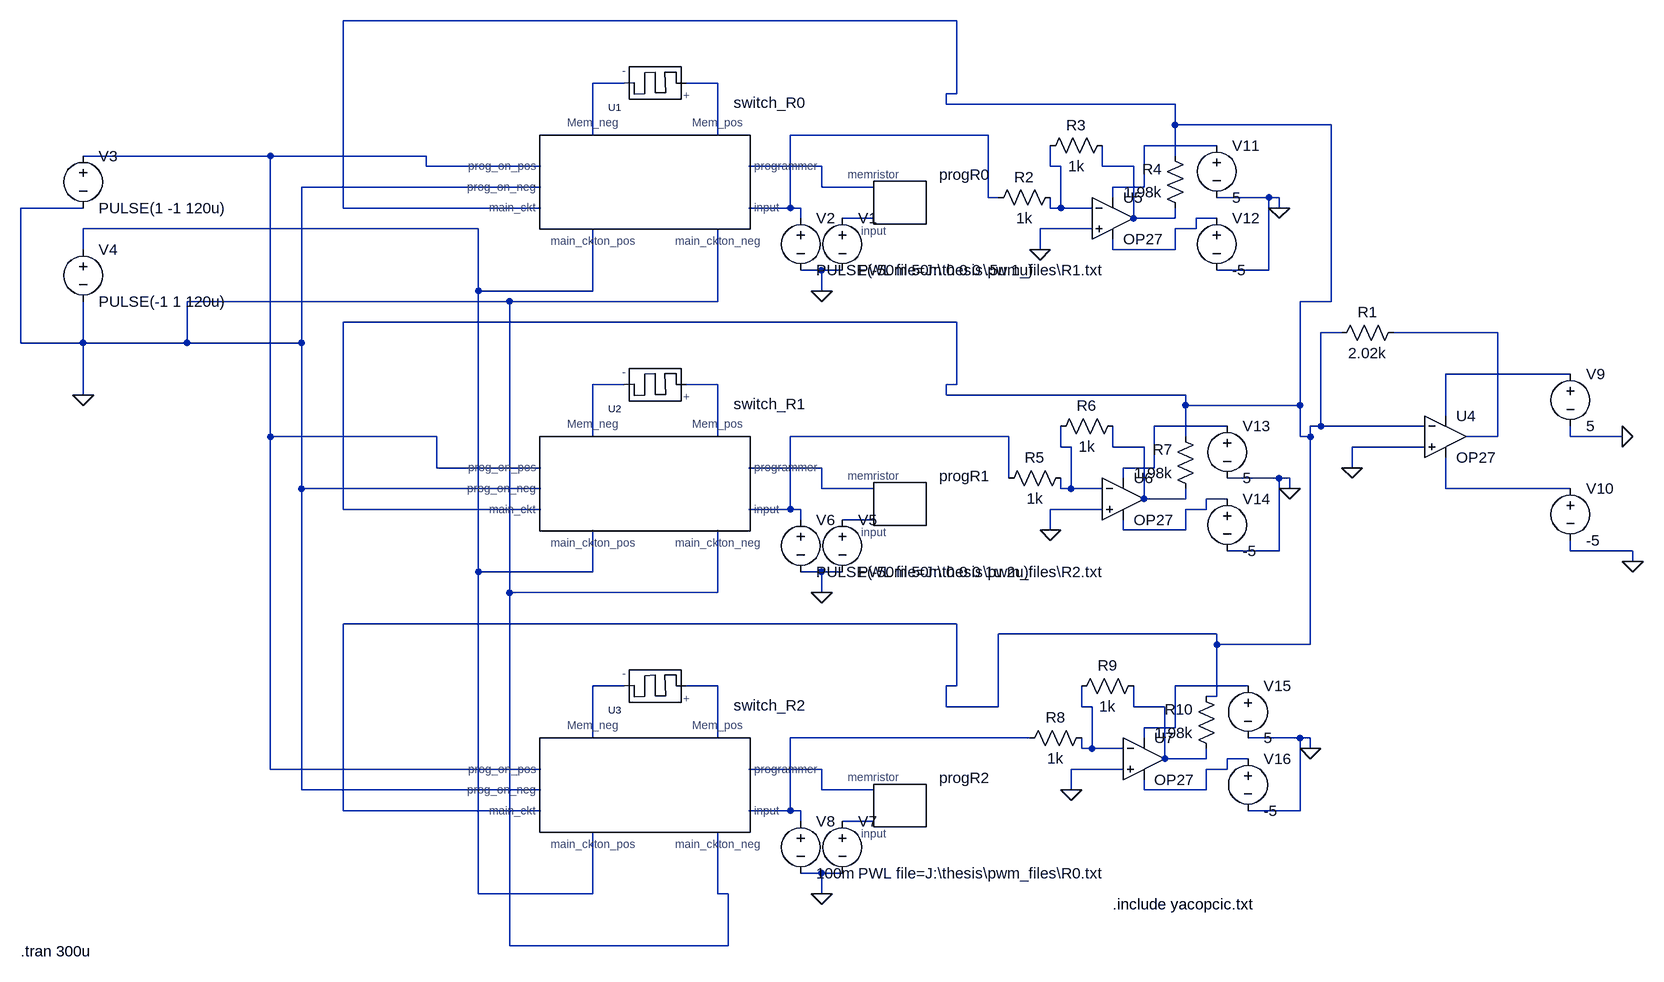
[diagram p0: schematic simul_mem.asc]
simul_mem.asc, the LTspice schematic file:
Version 4
SHEET 1 3396 1976
WIRE 2336 528 1392 528
WIRE 1824 624 1776 624
WIRE 1968 624 1920 624
WIRE 2336 640 2336 528
WIRE 2336 640 2320 640
WIRE 2320 656 2320 640
WIRE 2672 656 2320 656
WIRE 2672 688 2672 656
WIRE 2912 688 2672 688
WIRE 1776 704 1776 624
WIRE 1968 704 1968 624
WIRE 2384 704 2080 704
WIRE 2736 720 2624 720
WIRE 1280 736 992 736
WIRE 1520 736 1280 736
WIRE 2672 736 2672 688
WIRE 1520 752 1520 736
WIRE 1696 752 1520 752
WIRE 2128 752 2016 752
WIRE 2480 752 2480 720
WIRE 2496 752 2480 752
WIRE 2560 752 2560 720
WIRE 2608 752 2560 752
WIRE 1696 784 1328 784
WIRE 2128 784 2128 752
WIRE 2208 784 2128 784
WIRE 2624 784 2624 720
WIRE 2624 784 2576 784
WIRE 2384 800 2384 704
WIRE 2400 800 2384 800
WIRE 2576 800 2576 784
WIRE 2816 800 2736 800
WIRE 2832 800 2816 800
WIRE 992 816 896 816
WIRE 1392 816 1392 528
WIRE 1696 816 1392 816
WIRE 2080 816 2080 704
WIRE 2080 816 2016 816
WIRE 2096 816 2080 816
WIRE 2480 816 2480 800
WIRE 2496 816 2496 752
WIRE 2496 816 2480 816
WIRE 2544 816 2496 816
WIRE 2832 816 2832 800
WIRE 2096 832 2096 816
WIRE 2208 832 2160 832
WIRE 2608 832 2608 752
WIRE 2672 832 2672 816
WIRE 2672 832 2608 832
WIRE 2736 832 2704 832
WIRE 1600 848 992 848
WIRE 2544 848 2464 848
WIRE 2704 848 2704 832
WIRE 2704 848 2672 848
WIRE 992 880 992 848
WIRE 2464 880 2464 848
WIRE 2576 880 2576 864
WIRE 2672 880 2672 848
WIRE 2672 880 2576 880
WIRE 2128 912 2096 912
WIRE 2160 912 2128 912
WIRE 2816 912 2816 800
WIRE 2816 912 2736 912
WIRE 1600 944 1600 848
WIRE 1776 944 1776 848
WIRE 1776 944 1600 944
WIRE 2128 944 2128 912
WIRE 1648 960 1152 960
WIRE 1968 960 1968 848
WIRE 1968 960 1648 960
WIRE 2912 960 2912 688
WIRE 2912 960 2864 960
WIRE 2336 992 1392 992
WIRE 2928 1008 2896 1008
WIRE 3168 1008 3008 1008
WIRE 896 1024 896 816
WIRE 992 1024 992 960
WIRE 992 1024 896 1024
WIRE 1152 1024 1152 960
WIRE 1152 1024 992 1024
WIRE 1328 1024 1328 784
WIRE 1328 1024 1152 1024
WIRE 3280 1072 3088 1072
WIRE 1824 1088 1776 1088
WIRE 1968 1088 1920 1088
WIRE 2336 1088 2336 992
WIRE 2336 1088 2320 1088
WIRE 992 1104 992 1024
WIRE 2320 1104 2320 1088
WIRE 2688 1104 2320 1104
WIRE 2688 1120 2688 1104
WIRE 2864 1120 2864 960
WIRE 2864 1120 2688 1120
WIRE 3088 1136 3088 1072
WIRE 2752 1152 2640 1152
WIRE 2896 1152 2896 1008
WIRE 2896 1152 2880 1152
WIRE 3056 1152 2896 1152
WIRE 1280 1168 1280 736
WIRE 1536 1168 1280 1168
WIRE 1776 1168 1776 1088
WIRE 1968 1168 1968 1088
WIRE 2416 1168 2080 1168
WIRE 2688 1168 2688 1120
WIRE 2864 1168 2864 1120
WIRE 2880 1168 2880 1152
WIRE 2880 1168 2864 1168
WIRE 3168 1168 3168 1008
WIRE 3168 1168 3120 1168
WIRE 3280 1168 3280 1152
WIRE 3360 1168 3280 1168
WIRE 2496 1184 2496 1152
WIRE 2512 1184 2496 1184
WIRE 2576 1184 2576 1152
WIRE 2624 1184 2576 1184
WIRE 3056 1184 2944 1184
WIRE 1536 1216 1536 1168
WIRE 1696 1216 1536 1216
WIRE 2128 1216 2016 1216
WIRE 2640 1216 2640 1152
WIRE 2640 1216 2592 1216
WIRE 2944 1216 2944 1184
WIRE 2416 1232 2416 1168
WIRE 2592 1232 2592 1216
WIRE 2832 1232 2752 1232
WIRE 2848 1232 2832 1232
WIRE 1328 1248 1328 1024
WIRE 1696 1248 1328 1248
WIRE 2128 1248 2128 1216
WIRE 2208 1248 2128 1248
WIRE 2496 1248 2496 1232
WIRE 2512 1248 2512 1184
WIRE 2512 1248 2496 1248
WIRE 2560 1248 2512 1248
WIRE 2848 1248 2848 1232
WIRE 3088 1248 3088 1200
WIRE 3280 1248 3088 1248
WIRE 2624 1264 2624 1184
WIRE 2688 1264 2688 1248
WIRE 2688 1264 2624 1264
WIRE 2752 1264 2720 1264
WIRE 1392 1280 1392 992
WIRE 1696 1280 1392 1280
WIRE 2080 1280 2080 1168
WIRE 2080 1280 2016 1280
WIRE 2096 1280 2080 1280
WIRE 2560 1280 2480 1280
WIRE 2720 1280 2720 1264
WIRE 2720 1280 2688 1280
WIRE 2096 1296 2096 1280
WIRE 2208 1296 2160 1296
WIRE 2480 1312 2480 1280
WIRE 2592 1312 2592 1296
WIRE 2688 1312 2688 1280
WIRE 2688 1312 2592 1312
WIRE 2832 1344 2832 1232
WIRE 2832 1344 2752 1344
WIRE 3280 1344 3280 1328
WIRE 3376 1344 3280 1344
WIRE 3376 1360 3376 1344
WIRE 1600 1376 1600 944
WIRE 1776 1376 1776 1312
WIRE 1776 1376 1600 1376
WIRE 2128 1376 2096 1376
WIRE 2160 1376 2128 1376
WIRE 1648 1408 1648 960
WIRE 1968 1408 1968 1312
WIRE 1968 1408 1648 1408
WIRE 2128 1408 2128 1376
WIRE 2336 1456 1392 1456
WIRE 2736 1472 2400 1472
WIRE 2736 1488 2736 1472
WIRE 2880 1488 2880 1168
WIRE 2880 1488 2736 1488
WIRE 1824 1552 1776 1552
WIRE 1968 1552 1920 1552
WIRE 2336 1552 2336 1456
WIRE 2336 1552 2320 1552
WIRE 2784 1552 2672 1552
WIRE 2736 1568 2736 1488
WIRE 2736 1568 2720 1568
WIRE 2320 1584 2320 1552
WIRE 2400 1584 2400 1472
WIRE 2400 1584 2320 1584
WIRE 2528 1584 2528 1552
WIRE 2544 1584 2528 1584
WIRE 2608 1584 2608 1552
WIRE 2656 1584 2608 1584
WIRE 2672 1616 2672 1552
WIRE 2672 1616 2624 1616
WIRE 1776 1632 1776 1552
WIRE 1968 1632 1968 1552
WIRE 2448 1632 2080 1632
WIRE 2624 1632 2624 1616
WIRE 2864 1632 2784 1632
WIRE 2880 1632 2864 1632
WIRE 2528 1648 2528 1632
WIRE 2544 1648 2544 1584
WIRE 2544 1648 2528 1648
WIRE 2592 1648 2544 1648
WIRE 2880 1648 2880 1632
WIRE 2656 1664 2656 1584
WIRE 2720 1664 2720 1648
WIRE 2720 1664 2656 1664
WIRE 2784 1664 2752 1664
WIRE 1280 1680 1280 1168
WIRE 1696 1680 1280 1680
WIRE 2128 1680 2016 1680
WIRE 2592 1680 2512 1680
WIRE 2752 1680 2752 1664
WIRE 2752 1680 2720 1680
WIRE 1328 1712 1328 1248
WIRE 1696 1712 1328 1712
WIRE 2128 1712 2128 1680
WIRE 2208 1712 2128 1712
WIRE 2512 1712 2512 1680
WIRE 2624 1712 2624 1696
WIRE 2720 1712 2720 1680
WIRE 2720 1712 2624 1712
WIRE 1392 1744 1392 1456
WIRE 1696 1744 1392 1744
WIRE 2080 1744 2080 1632
WIRE 2080 1744 2016 1744
WIRE 2096 1744 2080 1744
WIRE 2864 1744 2864 1632
WIRE 2864 1744 2784 1744
WIRE 2096 1760 2096 1744
WIRE 2208 1760 2160 1760
WIRE 2128 1840 2096 1840
WIRE 2160 1840 2128 1840
WIRE 1600 1872 1600 1376
WIRE 1776 1872 1776 1776
WIRE 1776 1872 1600 1872
WIRE 1968 1872 1968 1776
WIRE 1984 1872 1968 1872
WIRE 2128 1872 2128 1840
WIRE 1648 1952 1648 1408
WIRE 1984 1952 1984 1872
WIRE 1984 1952 1648 1952
FLAG 2128 944 0
FLAG 2128 1408 0
FLAG 2128 1872 0
FLAG 992 1104 0
FLAG 2944 1216 0
FLAG 3360 1168 0
FLAG 3376 1360 0
FLAG 2464 880 0
FLAG 2832 816 0
FLAG 2480 1312 0
FLAG 2848 1248 0
FLAG 2512 1712 0
FLAG 2880 1648 0
SYMBOL memristormodel 1840 624 R180
SYMATTR InstName U1
SYMATTR Value MEM_YAKOPCIC
SYMBOL switch_block 1776 752 R0
SYMATTR InstName switch_R0
SYMBOL programmer_block 2256 832 R0
SYMATTR InstName progR0
SYMBOL voltage 2160 816 R0
WINDOW 123 0 0 Left 2
WINDOW 39 0 0 Left 2
SYMATTR InstName V1
SYMATTR Value PWL file=J:\thesis\pwm_files\R1.txt
SYMBOL voltage 2096 816 R0
WINDOW 123 0 0 Left 2
WINDOW 39 0 0 Left 2
SYMATTR InstName V2
SYMATTR Value PULSE(-50m 50m 0 0 0 .5u 1u)
SYMBOL voltage 992 720 R0
WINDOW 123 0 0 Left 2
WINDOW 39 0 0 Left 2
SYMATTR InstName V3
SYMATTR Value PULSE(1 -1 120u)
SYMBOL voltage 992 864 R0
WINDOW 123 0 0 Left 2
WINDOW 39 0 0 Left 2
SYMATTR InstName V4
SYMATTR Value PULSE(-1 1 120u)
SYMBOL memristormodel 1840 1088 R180
SYMATTR InstName U2
SYMATTR Value MEM_YAKOPCIC
SYMBOL switch_block 1776 1216 R0
SYMATTR InstName switch_R1
SYMBOL programmer_block 2256 1296 R0
SYMATTR InstName progR1
SYMBOL voltage 2160 1280 R0
WINDOW 123 0 0 Left 2
WINDOW 39 0 0 Left 2
SYMATTR InstName V5
SYMATTR Value PWL file=J:\thesis\pwm_files\R2.txt
SYMBOL voltage 2096 1280 R0
WINDOW 123 0 0 Left 2
WINDOW 39 0 0 Left 2
SYMATTR InstName V6
SYMATTR Value PULSE(-50m 50m 0 0 0 1u 2u)
SYMBOL memristormodel 1840 1552 R180
SYMATTR InstName U3
SYMATTR Value MEM_YAKOPCIC
SYMBOL switch_block 1776 1680 R0
SYMATTR InstName switch_R2
SYMBOL programmer_block 2256 1760 R0
SYMATTR InstName progR2
SYMBOL voltage 2160 1744 R0
WINDOW 123 0 0 Left 2
WINDOW 39 0 0 Left 2
SYMATTR InstName V7
SYMATTR Value PWL file=J:\thesis\pwm_files\R0.txt
SYMBOL voltage 2096 1744 R0
WINDOW 123 0 0 Left 2
WINDOW 39 0 0 Left 2
SYMATTR InstName V8
SYMATTR Value 100m
SYMBOL voltage 3280 1056 R0
WINDOW 123 0 0 Left 2
WINDOW 39 0 0 Left 2
SYMATTR InstName V9
SYMATTR Value 5
SYMBOL voltage 3280 1232 R0
WINDOW 123 0 0 Left 2
WINDOW 39 0 0 Left 2
SYMATTR InstName V10
SYMATTR Value -5
SYMBOL res 3024 992 R90
WINDOW 0 0 56 VBottom 2
WINDOW 3 32 56 VTop 2
SYMATTR InstName R1
SYMATTR Value 2.02k
SYMBOL res 2496 784 R90
WINDOW 0 0 56 VBottom 2
WINDOW 3 32 56 VTop 2
SYMATTR InstName R2
SYMATTR Value 1k
SYMBOL res 2576 704 R90
WINDOW 0 0 56 VBottom 2
WINDOW 3 32 56 VTop 2
SYMATTR InstName R3
SYMATTR Value 1k
SYMBOL res 2688 832 R180
WINDOW 0 36 76 Left 2
WINDOW 3 36 40 Left 2
SYMATTR InstName R4
SYMATTR Value 1.98k
SYMBOL voltage 2736 704 R0
WINDOW 123 0 0 Left 2
WINDOW 39 0 0 Left 2
SYMATTR InstName V11
SYMATTR Value 5
SYMBOL voltage 2736 816 R0
WINDOW 123 0 0 Left 2
WINDOW 39 0 0 Left 2
SYMATTR InstName V12
SYMATTR Value -5
SYMBOL res 2512 1216 R90
WINDOW 0 0 56 VBottom 2
WINDOW 3 32 56 VTop 2
SYMATTR InstName R5
SYMATTR Value 1k
SYMBOL res 2592 1136 R90
WINDOW 0 0 56 VBottom 2
WINDOW 3 32 56 VTop 2
SYMATTR InstName R6
SYMATTR Value 1k
SYMBOL res 2704 1264 R180
WINDOW 0 36 76 Left 2
WINDOW 3 36 40 Left 2
SYMATTR InstName R7
SYMATTR Value 1.98k
SYMBOL voltage 2752 1136 R0
WINDOW 123 0 0 Left 2
WINDOW 39 0 0 Left 2
SYMATTR InstName V13
SYMATTR Value 5
SYMBOL voltage 2752 1248 R0
WINDOW 123 0 0 Left 2
WINDOW 39 0 0 Left 2
SYMATTR InstName V14
SYMATTR Value -5
SYMBOL res 2544 1616 R90
WINDOW 0 0 56 VBottom 2
WINDOW 3 32 56 VTop 2
SYMATTR InstName R8
SYMATTR Value 1k
SYMBOL res 2624 1536 R90
WINDOW 0 0 56 VBottom 2
WINDOW 3 32 56 VTop 2
SYMATTR InstName R9
SYMATTR Value 1k
SYMBOL res 2736 1664 R180
WINDOW 0 36 76 Left 2
WINDOW 3 36 40 Left 2
SYMATTR InstName R10
SYMATTR Value 1.98k
SYMBOL voltage 2784 1536 R0
WINDOW 123 0 0 Left 2
WINDOW 39 0 0 Left 2
SYMATTR InstName V15
SYMATTR Value 5
SYMBOL voltage 2784 1648 R0
WINDOW 123 0 0 Left 2
WINDOW 39 0 0 Left 2
SYMATTR InstName V16
SYMATTR Value -5
SYMBOL Opamps\\OP27 2576 768 R0
SYMATTR InstName U5
SYMBOL Opamps\\OP27 2592 1200 R0
SYMATTR InstName U6
SYMBOL Opamps\\OP27 2624 1600 R0
SYMATTR InstName U7
SYMBOL Opamps\\OP27 3088 1104 R0
SYMATTR InstName U4
TEXT 2576 1888 Left 2 !.include yacopcic.txt
TEXT 896 1960 Left 2 !.tran 300u

The netlist it stands for:
* simul_mem.asc
XU1 N003 N002 M MEM_YAKOPCIC  ; pins + -
Xswitch_R0 N002 N003 N006 0 N001 N012 0 N007 N004 switch_block  ; pins Mem_neg Mem_pos prog_on_pos prog_on_neg main_ckt main_ckton_pos main_ckton_neg programmer input
XprogR0 N007 N010 programmer_block  ; pins memristor input
V1 N010 0 PWL file=J:\thesis\pwm_files\R1.txt
V2 N004 0 PULSE(-50m 50m 0 0 0 .5u 1u)
V3 N006 0 PULSE(1 -1 120u)
V4 N012 0 PULSE(-1 1 120u)
XU2 N016 N015 M MEM_YAKOPCIC  ; pins + -
Xswitch_R1 N015 N016 N006 0 N001 N012 0 N021 N018 switch_block  ; pins Mem_neg Mem_pos prog_on_pos prog_on_neg main_ckt main_ckton_pos main_ckton_neg programmer input
XprogR1 N021 N024 programmer_block  ; pins memristor input
V5 N024 0 PWL file=J:\thesis\pwm_files\R2.txt
V6 N018 0 PULSE(-50m 50m 0 0 0 1u 2u)
XU3 N026 N025 M MEM_YAKOPCIC  ; pins + -
Xswitch_R2 N025 N026 N006 0 N001 N012 0 N032 N030 switch_block  ; pins Mem_neg Mem_pos prog_on_pos prog_on_neg main_ckt main_ckton_pos main_ckton_neg programmer input
XprogR2 N032 N033 programmer_block  ; pins memristor input
V7 N033 0 PWL file=J:\thesis\pwm_files\R0.txt
V8 N030 0 100m
V9 N014 0 5
V10 N022 0 -5
R1 N013 N001 2.02k
R2 N008 N004 1k
R3 N009 N008 1k
R4 N009 N001 1.98k
V11 N005 0 5
V12 N011 0 -5
R5 N019 N018 1k
R6 N020 N019 1k
R7 N020 N001 1.98k
V13 N017 0 5
V14 N023 0 -5
R8 N028 N030 1k
R9 N029 N028 1k
R10 N029 N001 1.98k
V15 N027 0 5
V16 N031 0 -5
XU5 0 N008 N005 N011 N009 OP27  ; pins In+ In- V+ V- OUT
XU6 0 N019 N017 N023 N020 OP27  ; pins In+ In- V+ V- OUT
XU7 0 N028 N027 N031 N029 OP27  ; pins In+ In- V+ V- OUT
XU4 0 N001 N014 N022 N013 OP27  ; pins In+ In- V+ V- OUT
.include yacopcic.txt
.tran 300u
.lib ADI.lib
.backanno
.end